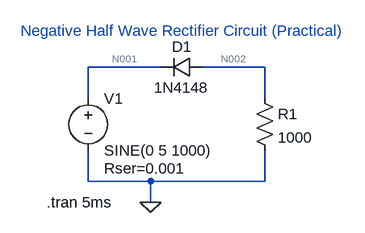
[diagram p0: schematic Assignment 3b (i).asc]
Assignment 3b (i).asc, the LTspice schematic file:
Version 4.1
SHEET 1 880 680
WIRE 192 64 80 64
WIRE 352 64 256 64
WIRE 80 112 80 64
WIRE 352 112 352 64
WIRE 80 240 80 192
WIRE 176 240 80 240
WIRE 352 240 352 192
WIRE 352 240 176 240
WIRE 176 272 176 240
FLAG 176 272 0
SYMBOL voltage 80 96 R0
WINDOW 123 0 0 Left 2
WINDOW 39 24 124 Left 2
SYMATTR SpiceLine Rser=0.001
SYMATTR InstName V1
SYMATTR Value SINE(0 5 1000)
SYMBOL res 336 96 R0
SYMATTR InstName R1
SYMATTR Value 1000
SYMBOL diode 256 48 R90
WINDOW 0 0 32 VBottom 2
WINDOW 3 32 32 VTop 2
SYMATTR InstName D1
SYMATTR Value 1N4148
TEXT 16 272 Left 2 !.tran 5ms
TEXT -24 8 Left 2 ;Negative Half Wave Rectifier Circuit (Practical)

The netlist it stands for:
* Assignment 3b (i).asc
V1 N001 0 SINE(0 5 1000) Rser=0.001
R1 N002 0 1000
D1 N002 N001 1N4148
.model D D
.lib standard.dio
.tran 5ms
* Negative Half Wave Rectifier Circuit (Practical)
.backanno
.end

* Results of the author's LTspice run, read from the files saved beside the schematic
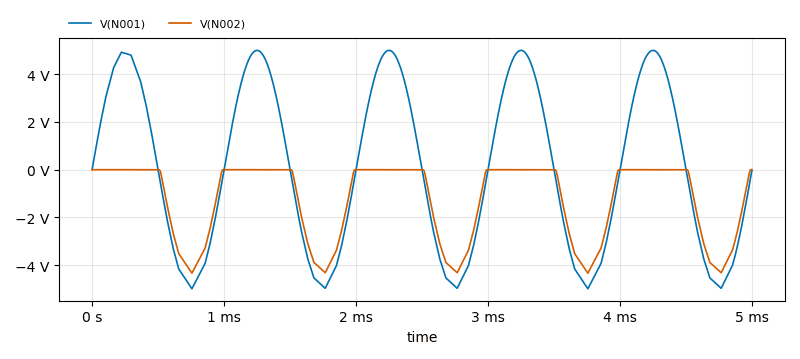
[diagram p1: Transient Analysis of Assignment 3b (i).asc, plotted from the saved traces]
* Transient Analysis, 1 run:
*   V(N001): min -4.991 V, max 5 V, average 23.76 mV, rms 3.504 V, last 0 V
*   V(N002): min -4.338 V, max 158 µV, average -1.266 V, rms 2.062 V, last 154.3 µV